# Altium schematic sheet Safety_Protections.SchDoc: Safety Protections
size A3; DrawnBy: Juan Tinazzo; SheetNumber: 2; SheetTotal: 7; Number: CB-SP; Company: TM
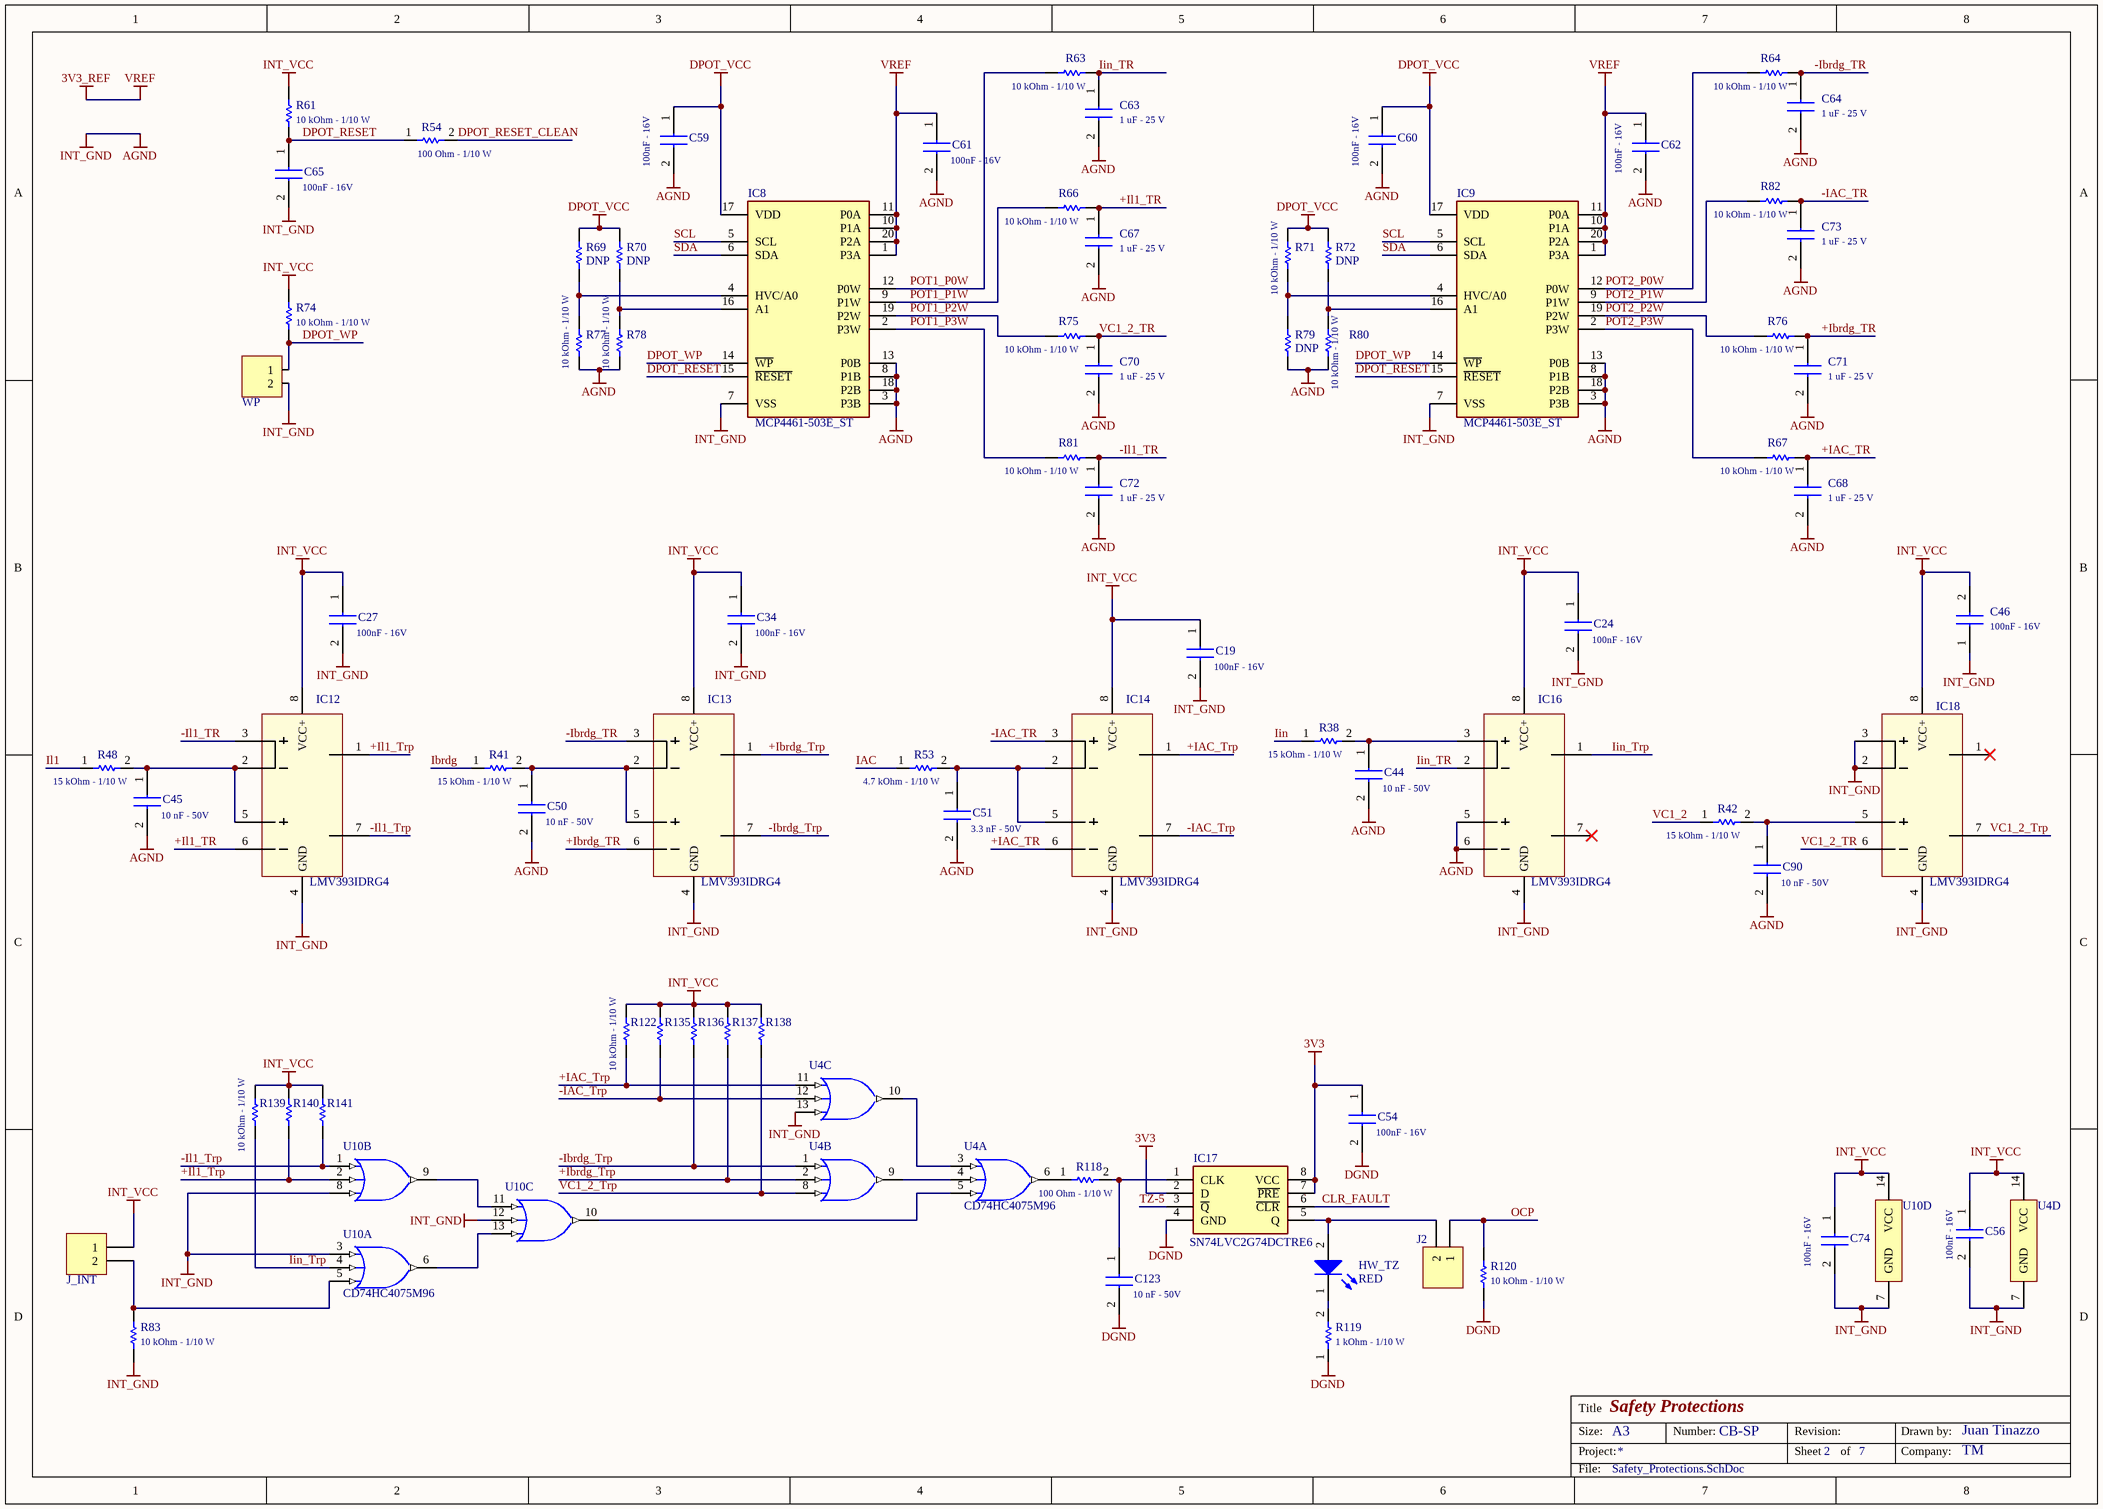
[diagram p0: Safety_Protections.SchDoc]

## Parts
C19  value 100nF - 16V  [CAPC1608X95N]  (hidden comment: 100n 16V 0603)
C24  value 100nF - 16V  [CAPC1608X95N]  (hidden comment: 100n 16V 0603)
C27  value 100nF - 16V  [CAPC1608X95N]  (hidden comment: 100n 16V 0603)
C34  value 100nF - 16V  [CAPC1608X95N]  (hidden comment: 100n 16V 0603)
C44  value 10 nF - 50V  [C0603]  (hidden comment: 220p 50V 5% 0603)
C45  value 10 nF - 50V  [C0603]  (hidden comment: 220p 50V 5% 0603)
C46  value 100nF - 16V  [CAPC1608X95N]  (hidden comment: 100n 16V 0603)
C50  value 10 nF - 50V  [C0603]  (hidden comment: 220p 50V 5% 0603)
C51  value 3.3 nF - 50V  [C0603]  (hidden comment: 220p 50V 5% 0603)
C54  value 100nF - 16V  [CAPC1608X95N]  (hidden comment: 100n 16V 0603)
C56  value 100nF - 16V  [CAPC1608X95N]  (hidden comment: 100n 16V 0603)
C59  value 100nF - 16V  [CAPC1608X95N]  (hidden comment: 100n 16V 0603)
C60  value 100nF - 16V  [CAPC1608X95N]  (hidden comment: 100n 16V 0603)
C61  value 100nF - 16V  [CAPC1608X95N]  (hidden comment: 100n 16V 0603)
C62  value 100nF - 16V  [CAPC1608X95N]  (hidden comment: 100n 16V 0603)
C63  value 1 uF - 25 V  [CAPC2012X135N]  (hidden comment: 1u)
C64  value 1 uF - 25 V  [CAPC2012X135N]  (hidden comment: 1u)
C65  value 100nF - 16V  [CAPC1608X95N]  (hidden comment: 100n 16V 0603)
C67  value 1 uF - 25 V  [CAPC2012X135N]  (hidden comment: 1u)
C68  value 1 uF - 25 V  [CAPC2012X135N]  (hidden comment: 1u)
C70  value 1 uF - 25 V  [CAPC2012X135N]  (hidden comment: 1u)
C71  value 1 uF - 25 V  [CAPC2012X135N]  (hidden comment: 1u)
C72  value 1 uF - 25 V  [CAPC2012X135N]  (hidden comment: 1u)
C73  value 1 uF - 25 V  [CAPC2012X135N]  (hidden comment: 1u)
C74  value 100nF - 16V  [CAPC1608X95N]  (hidden comment: 100n 16V 0603)
C90  value 10 nF - 50V  [C0603]  (hidden comment: 220p 50V 5% 0603)
C123  value 10 nF - 50V  [C0603]  (hidden comment: 220p 50V 5% 0603)
HW_TZ  RED  [LEDC1608X80N]
IC8  MCP4461-503E_ST  [SOP65P640X120-20N]
IC9  MCP4461-503E_ST  [SOP65P640X120-20N]
IC12  LMV393IDRG4  [SOIC127P600X175-8N]
IC13  LMV393IDRG4  [SOIC127P600X175-8N]
IC14  LMV393IDRG4  [SOIC127P600X175-8N]
IC16  LMV393IDRG4  [SOIC127P600X175-8N]
IC17  SN74LVC2G74DCTRE6  [SOP65P400X130-8N]
IC18  LMV393IDRG4  [SOIC127P600X175-8N]
J2  Header 2  [HDR1X2]  (value not drawn)
J_INT  Header 2  [HDR1X2]  (value not drawn)
R38  value 15 kOhm - 1/10 W  [RESC1608X55N]  (hidden comment: CRCW0603100RFKEBC)
R41  value 15 kOhm - 1/10 W  [RESC1608X55N]  (hidden comment: CRCW0603100RFKEBC)
R42  value 15 kOhm - 1/10 W  [RESC1608X55N]  (hidden comment: CRCW0603100RFKEBC)
R48  value 15 kOhm - 1/10 W  [RESC1608X55N]  (hidden comment: CRCW0603100RFKEBC)
R53  value 4.7 kOhm - 1/10 W  [RESC1608X55N]  (hidden comment: CRCW0603100RFKEBC)
R54  value 100 Ohm - 1/10 W  [RESC1608X55N]  (hidden comment: CRCW0603100RFKEBC)
R61  value 10 kOhm - 1/10 W  [RESC1608X50N]  (hidden comment: CRCW060310K0FKEA)
R63  value 10 kOhm - 1/10 W  [RESC1608X50N]  (hidden comment: CRCW060310K0FKEA)
R64  value 10 kOhm - 1/10 W  [RESC1608X50N]  (hidden comment: CRCW060310K0FKEA)
R66  value 10 kOhm - 1/10 W  [RESC1608X50N]  (hidden comment: CRCW060310K0FKEA)
R67  value 10 kOhm - 1/10 W  [RESC1608X50N]  (hidden comment: CRCW060310K0FKEA)
R69  DNP  [RESC1608X50N]
R70  DNP  [RESC1608X50N]
R71  value 10 kOhm - 1/10 W  [RESC1608X50N]  (hidden comment: CRCW060310K0FKEA)
R72  DNP  [RESC1608X50N]
R74  value 10 kOhm - 1/10 W  [RESC1608X50N]  (hidden comment: CRCW060310K0FKEA)
R75  value 10 kOhm - 1/10 W  [RESC1608X50N]  (hidden comment: CRCW060310K0FKEA)
R76  value 10 kOhm - 1/10 W  [RESC1608X50N]  (hidden comment: CRCW060310K0FKEA)
R77  value 10 kOhm - 1/10 W  [RESC1608X50N]  (hidden comment: CRCW060310K0FKEA)
R78  value 10 kOhm - 1/10 W  [RESC1608X50N]  (hidden comment: CRCW060310K0FKEA)
R79  DNP  [RESC1608X50N]
R80  value 10 kOhm - 1/10 W  [RESC1608X50N]  (hidden comment: CRCW060310K0FKEA)
R81  value 10 kOhm - 1/10 W  [RESC1608X50N]  (hidden comment: CRCW060310K0FKEA)
R82  value 10 kOhm - 1/10 W  [RESC1608X50N]  (hidden comment: CRCW060310K0FKEA)
R83  value 10 kOhm - 1/10 W  [RESC1608X50N]  (hidden comment: CRCW060310K0FKEA)
R118  value 100 Ohm - 1/10 W  [RESC1608X55N]  (hidden comment: CRCW0603100RFKEBC)
R119  value 1 kOhm - 1/10 W  [RESC1608X55N]  (hidden comment: CRCW06031K00FKEAC)
R120  value 10 kOhm - 1/10 W  [RESC1608X50N]  (hidden comment: CRCW060310K0FKEA)
R122  value 10 kOhm - 1/10 W  [RESC1608X50N]  (hidden comment: CRCW060310K0FKEA)
R135  CRCW060310K0FKEA  [RESC1608X50N]  (value not drawn)
R136  CRCW060310K0FKEA  [RESC1608X50N]  (value not drawn)
R137  CRCW060310K0FKEA  [RESC1608X50N]  (value not drawn)
R138  CRCW060310K0FKEA  [RESC1608X50N]  (value not drawn)
R139  value 10 kOhm - 1/10 W  [RESC1608X50N]  (hidden comment: CRCW060310K0FKEA)
R140  CRCW060310K0FKEA  [RESC1608X50N]  (value not drawn)
R141  CRCW060310K0FKEA  [RESC1608X50N]  (value not drawn)
U4  CD74HC4075M96  [SOIC127P600X175-14N]  (parts A,B,C,D of 4)
U10  CD74HC4075M96  [SOIC127P600X175-14N]  (parts A,B,C,D of 4)
WP  Header 2  [HDR1X2]  (value not drawn)

## Nets
3V3: C54.1 IC17.2(D) IC17.7(~{PRE}) IC17.8(VCC)
3V3_REF: C61.1 C62.1 IC8.1(P3A) IC8.10(P1A) IC8.11(P0A) IC8.20(P2A) IC9.1(P3A) IC9.10(P1A) IC9.11(P0A) IC9.20(P2A)  [also labelled VREF]
AGND: C19.2 C24.2 C27.2 C34.2 C44.2 C45.2 C46.1 C50.2 C51.2 C56.2 C59.2 C60.2 C61.2 C62.2 C63.2 C64.2 C65.2 C67.2 C68.2 C70.2 C71.2 C72.2 C73.2 C74.2 C90.2 IC8.3(P3B) IC8.7(VSS) IC8.8(P1B) IC8.13(P0B) IC8.18(P2B) IC9.3(P3B) IC9.7(VSS) IC9.8(P1B) IC9.13(P0B) IC9.18(P2B) IC12.4(GND) IC13.4(GND) IC14.4(GND) IC16.4(GND) IC16.5(2IN+) IC16.6(2IN-) IC18.2(1IN-) IC18.3(1IN+) IC18.4(GND) R77.2 R78.2 R79.2 R80.2 R83.2 U4.7(GND) U4.13(3C) U10.3(1A) U10.7(GND) U10.8(2C) U10.12(3B) WP.2  [also labelled INT_GND]
DGND: C54.2 C123.2 IC17.4(GND) R119.1 R120.2
DPOT_VCC: C59.1 C60.1 IC8.17(VDD) IC9.17(VDD) R69.1 R70.1 R71.1 R72.1
INT_VCC: C19.1 C24.1 C27.1 C34.1 C46.2 C56.1 C74.1 IC12.8(VCC+) IC13.8(VCC+) IC14.8(VCC+) IC16.8(VCC+) IC18.8(VCC+) J_INT.1 R61.1 R74.1 R122.1 R135.1 R136.1 R137.1 R138.1 R139.1 R140.1 R141.1 U4.14(VCC) U10.14(VCC)
+IAC_TR: C68.1 IC14.6(2IN-) R67.1
+IAC_Trp: IC14.1(1OUT) R122.2 U4.11(3A)
+Ibrdg_TR: C71.1 IC13.6(2IN-) R76.1
+Ibrdg_Trp: IC13.1(1OUT) R137.2 U4.2(2B)
+Il1_TR: C67.1 IC12.6(2IN-) R66.1
+Il1_Trp: IC12.1(1OUT) R140.2 U10.2(2B)
-IAC_TR: C73.1 IC14.3(1IN+) R82.1
-IAC_Trp: IC14.7(2OUT) R135.2 U4.12(3B)
-Ibrdg_TR: C64.1 IC13.3(1IN+) R64.1
-Ibrdg_Trp: IC13.7(2OUT) R136.2 U4.1(2A)
-Il1_TR: C72.1 IC12.3(1IN+) R81.1
-Il1_Trp: IC12.7(2OUT) R141.2 U10.1(2A)
CLR_FAULT: IC17.6(~{CLR})
DPOT_RESET: C65.1 IC8.15(~{RESET}) IC9.15(~{RESET}) R54.1 R61.2
DPOT_RESET_CLEAN: R54.2
DPOT_WP: IC8.14(~{WP}) IC9.14(~{WP}) R74.2 WP.1
IAC: R53.1
Ibrdg: R41.1
Iin: R38.1
Iin_TR: C63.1 IC16.2(1IN-) R63.1
Iin_Trp: IC16.1(1OUT) R139.2 U10.4(1B)
Il1: R48.1
OCP: J2.1 R120.1
POT1_P0W: IC8.12(P0W) R63.2
POT1_P1W: IC8.9(P1W) R66.2
POT1_P2W: IC8.19(P2W) R75.2
POT1_P3W: IC8.2(P3W) R81.2
POT2_P0W: IC9.12(P0W) R64.2
POT2_P1W: IC9.9(P1W) R82.2
POT2_P2W: IC9.19(P2W) R76.2
POT2_P3W: IC9.2(P3W) R67.2
SCL: IC8.5(SCL) IC9.5(SCL)
SDA: IC8.6(SDA) IC9.6(SDA)
TZ-5: IC17.3(~{Q})
VC1_2: R42.1
VC1_2_TR: C70.1 IC18.6(2IN-) R75.1
VC1_2_Trp: IC18.7(2OUT) R138.2 U4.8(2C)
NetC44_1: C44.1 IC16.3(1IN+) R38.2
NetC45_1: C45.1 IC12.2(1IN-) IC12.5(2IN+) R48.2
NetC50_1: C50.1 IC13.2(1IN-) IC13.5(2IN+) R41.2
NetC51_1: C51.1 IC14.2(1IN-) IC14.5(2IN+) R53.2
NetC90_1: C90.1 IC18.5(2IN+) R42.2
NetC123_1: C123.1 IC17.1(CLK) R118.2
NetHW_TZ_1: HW_TZ.1(K) R119.2
NetHW_TZ_2: HW_TZ.2(A) IC17.5(Q) J2.2
NetIC8_4: IC8.4(HVC/A0) R69.2 R77.1
NetIC8_16: IC8.16(A1) R70.2 R78.1
NetIC9_4: IC9.4(HVC/A0) R71.2 R79.1
NetIC9_16: IC9.16(A1) R72.2 R80.1
NetJ_INT_2: J_INT.2 R83.1 U10.5(1C)
NetR118_1: R118.1 U4.6(1Y)
NetU4_3: U4.3(1A) U4.10(3Y)
NetU4_4: U4.4(1B) U4.9(2Y)
NetU4_5: U4.5(1C) U10.10(3Y)
NetU10_6: U10.6(1Y) U10.13(3C)
NetU10_9: U10.9(2Y) U10.11(3A)

Not connected (* = marked no-connect by the designer): IC16 7(2OUT)*; IC18 1(1OUT)*

## Notes on the sheet
- Title
- Size:
- Project:
- A3
- Number:
- Revision:
- Sheet
- of
- Drawn by:
- Company:
- File:

## Library data of the parts
C19 C24 C27 C34 C46 C54 C56 C59-C62 C65 C74 = EMK107B7104KA-T: Capacitor; Manufacturer_Name: TAIYO YUDEN; Datasheet Link: http://www.farnell.com/datasheets/746258.pdf; Height: 0.95mm; Manufacturer_Part_Number: EMK107B7104KA-T; Mouser Part Number: 963-EMK107B7104KA-T; Arrow Part Number: EMK107B7104KA-T; Arrow Price/Stock: https://www.arrow.com/en/products/emk107b7104ka-t/taiyo-yuden
  C19 C24 C27 C34 C54 C56 C59-C62 C65 C74: Mouser Price/Stock: https://www.mouser.co.uk/ProductDetail/Taiyo-Yuden/EMK107B7104KA-T?qs=I6KAKw0tg2ybqzX8hKPgfw%3D%3D
  C46: Mouser Price/Stock: https://www.mouser.co.uk/ProductDetail/TAIYO-YUDEN/EMK107B7104KA-T?qs=I6KAKw0tg2ybqzX8hKPgfw%3D%3D
C44 C45 C50 C90 C123 = C0603C221J5HACAUTO: Capacitor; Manufacturer_Name: KEMET; Manufacturer_Part_Number: CGA3E2X7R1H103K080AA; Datasheet Link: https://content.kemet.com/datasheets/KEM_C1007_X8R_ULTRA_150C_SMD.pdf; Height: 0.87mm; Mouser Part Number: 80-C0603C221J5HAUTO; Mouser Price/Stock: https://www.mouser.co.uk/ProductDetail/KEMET/C0603C221J5HACAUTO?qs=j%252B1pi9TdxUZayjzZ3rh80g%3D%3D
C51 = C0603C221J5HACAUTO: Capacitor; Manufacturer_Name: KEMET; Datasheet Link: https://content.kemet.com/datasheets/KEM_C1007_X8R_ULTRA_150C_SMD.pdf; Height: 0.87mm; Manufacturer_Part_Number: C0603C221J5HACAUTO; Mouser Part Number: 80-C0603C221J5HAUTO; Mouser Price/Stock: https://www.mouser.co.uk/ProductDetail/KEMET/C0603C221J5HACAUTO?qs=j%252B1pi9TdxUZayjzZ3rh80g%3D%3D
C63 C64 C67 C68 C70-C73 = CL21B105KAFNNNG: Capacitor; Manufacturer_Name: SAMSUNG; Datasheet Link: https://datasheet.datasheetarchive.com/originals/distributors/Datasheets-DGA8/2478773.pdf; Height: 1.35mm; Manufacturer_Part_Number: CL21B105KAFNNNG; Mouser Part Number: 187-CL21B105KAFNNNG; Mouser Price/Stock: https://www.mouser.co.uk/ProductDetail/Samsung-Electro-Mechanics/CL21B105KAFNNNG?qs=yOVawPpwOwmXkU%252BG0TK%2F5g%3D%3D; Arrow Part Number: CL21B105KAFNNNG; Arrow Price/Stock: https://www.arrow.com/en/products/cl21b105kafnnng/samsung-electro-mechanics?region=europe
HW_TZ = 150060RS75000: LED; Manufacturer_Name: Wurth Elektronik; Value: Led Rojo 0603; Datasheet Link: http://katalog.we-online.de/led/datasheet/150060RS75000.pdf; Height: 0.8mm; Manufacturer_Part_Number: 150060RS75000; Mouser Part Number: 710-150060RS75000; Mouser Price/Stock: https://www.mouser.co.uk/ProductDetail/Wurth-Elektronik/150060RS75000?qs=LlUlMxKIyB3QnmZ3fw%2FVCA%3D%3D
IC8 IC9 = MCP4461-503E_ST: Integrated Circuit; Manufacturer_Name: Microchip; Manufacturer_Part_Number: MCP4461-503E/ST; Value: Circuitos integrados de potenciómetros digitales 50k I2C quad ch 8bit nonvolatile memory; Datasheet Link: https://datasheet.datasheetarchive.com/originals/dk/DKDS-14/279656.pdf; Height: 1.2mm; Mouser Part Number: 579-MCP4461503EST; Mouser Price/Stock: https://www.mouser.co.uk/ProductDetail/Microchip-Technology/MCP4461-503E-ST?qs=hort8UWU32ogb6GG%252BEGOkQ%3D%3D; Arrow Part Number: MCP4461-503E/ST; Arrow Price/Stock: https://www.arrow.com/en/products/mcp4461-503est/microchip-technology
IC12-IC14 IC16 IC18 = LMV393IDRG4: Integrated Circuit; Manufacturer_Name: Texas Instruments; Value: Comparadores analógicos Dual Gen Purp; Datasheet Link: https://www.ti.com/lit/gpn/lmv393; Height: 1.75mm; Manufacturer_Part_Number: LMV393IDRG4; Mouser Part Number: 595-LMV393IDRG4; Mouser Price/Stock: https://www.mouser.co.uk/ProductDetail/Texas-Instruments/LMV393IDRG4?qs=tP77tliwutC5frth4oKpcg%3D%3D; Arrow Part Number: LMV393IDRG4; Arrow Price/Stock: https://www.arrow.com/en/products/lmv393idrg4/texas-instruments?region=nac
IC17 = SN74LVC2G74DCTRE6: Integrated Circuit; Manufacturer_Name: Texas Instruments; Value: Single Positive-Edge-Triggered D-Type Flip-Flop; Datasheet Link: https://www.ti.com/lit/ds/symlink/sn74lvc2g74.pdf?ts=1629109043918&ref_url=https%253A%252F%252Fwww.ti.com%252Fstore%252Fti%252Fen%252Fp%252Fproduct%252F%253Fp%253DSN74LVC2G74DCTRE6; Height: 1.3mm; Manufacturer_Part_Number: SN74LVC2G74DCTRE6; Mouser Part Number: 595-74LVC2G74DCTRE6; Mouser Price/Stock: https://www.mouser.co.uk/ProductDetail/Texas-Instruments/SN74LVC2G74DCTRE6?qs=byeeYqUIh0MaOLKxYGSbxw%3D%3D; Arrow Part Number: SN74LVC2G74DCTRE6; Arrow Price/Stock: https://www.arrow.com/en/products/sn74lvc2g74dctre6/texas-instruments?region=nac
J2 J_INT WP = Header 2: Header, 2-Pin; Manufacturer_Part_Number: Header 2.54 mm 2P; Value: 2P
R38 R41 R42 R48 = CRCW0603100RFKEBC: Resistor; Manufacturer_Name: Vishay; Manufacturer_Part_Number: CRCW060315K0FKEAC; Datasheet Link: https://www.vishay.com/docs/28773/crcwce3.pdf; Height: 0.55mm; Mouser Part Number: 71-CRCW0603100RFKEBC; Mouser Price/Stock: https://www.mouser.co.uk/ProductDetail/Vishay-Dale/CRCW0603100RFKEBC?qs=wd5RIQLrsJhdvQFtBw4oWg%3D%3D; Arrow Part Number: CRCW0603100RFKEBC; Arrow Price/Stock: https://www.arrow.com/en/products/crcw0603100rfkebc/vishay?region=nac
R53 = CRCW0603100RFKEBC: Resistor; Manufacturer_Name: Vishay; Manufacturer_Part_Number: CRCW06034K70FKEAHP; Datasheet Link: https://www.vishay.com/docs/28773/crcwce3.pdf; Height: 0.55mm; Mouser Part Number: 71-CRCW0603100RFKEBC; Mouser Price/Stock: https://www.mouser.co.uk/ProductDetail/Vishay-Dale/CRCW0603100RFKEBC?qs=wd5RIQLrsJhdvQFtBw4oWg%3D%3D; Arrow Part Number: CRCW0603100RFKEBC; Arrow Price/Stock: https://www.arrow.com/en/products/crcw0603100rfkebc/vishay?region=nac
R54 R118 = CRCW0603100RFKEBC: Resistor; Manufacturer_Name: Vishay; Datasheet Link: https://www.vishay.com/docs/28773/crcwce3.pdf; Height: 0.55mm; Manufacturer_Part_Number: CRCW0603100RFKEBC; Mouser Part Number: 71-CRCW0603100RFKEBC; Mouser Price/Stock: https://www.mouser.co.uk/ProductDetail/Vishay-Dale/CRCW0603100RFKEBC?qs=wd5RIQLrsJhdvQFtBw4oWg%3D%3D; Arrow Part Number: CRCW0603100RFKEBC; Arrow Price/Stock: https://www.arrow.com/en/products/crcw0603100rfkebc/vishay?region=nac
R61 R63 R64 R66 R67 R71 R74-R78 R80-R83 R120 R122 R139 = CRCW060310K0FKEA: Resistor; Manufacturer_Name: Vishay; Datasheet Link: http://www.vishay.com/docs/20035/dcrcwe3.pdf; Height: 0.5mm; Manufacturer_Part_Number: CRCW060310K0FKEA; Mouser Part Number: 71-CRCW0603-10K-E3; Mouser Price/Stock: https://www.mouser.co.uk/ProductDetail/Vishay-Dale/CRCW060310K0FKEA?qs=pAO1Z172M84BVnhDjtnsoQ%3D%3D; Arrow Part Number: CRCW060310K0FKEA; Arrow Price/Stock: https://www.arrow.com/en/products/crcw060310k0fkea/vishay?region=nac
R69 R70 R72 R79 R135-R138 R140 R141 = CRCW060310K0FKEA: Resistor; Manufacturer_Name: Vishay; Value: 10 kOhm - 1/10 W; Datasheet Link: http://www.vishay.com/docs/20035/dcrcwe3.pdf; Height: 0.5mm; Manufacturer_Part_Number: CRCW060310K0FKEA; Mouser Part Number: 71-CRCW0603-10K-E3; Mouser Price/Stock: https://www.mouser.co.uk/ProductDetail/Vishay-Dale/CRCW060310K0FKEA?qs=pAO1Z172M84BVnhDjtnsoQ%3D%3D; Arrow Part Number: CRCW060310K0FKEA; Arrow Price/Stock: https://www.arrow.com/en/products/crcw060310k0fkea/vishay?region=nac
R119 = CRCW06031K00FKEAC: Resistor; Manufacturer_Name: Vishay; Datasheet Link: https://www.vishay.com/docs/28773/crcwce3.pdf; Height: 0.55mm; Manufacturer_Part_Number: CRCW06031K00FKEAC; Mouser Part Number: 71-CRCW06031K00FKEAC; Mouser Price/Stock: https://www.mouser.co.uk/ProductDetail/Vishay-Dale/CRCW06031K00FKEAC?qs=E3Y5ESvWgWOQ7ePIWbGVFg%3D%3D; Arrow Part Number: CRCW06031K00FKEAC; Arrow Price/Stock: https://www.arrow.com/en/products/crcw06031k00fkeac/vishay?region=nac
U4 U10 = CD74HC4075M96: High Speed CMOS Logic Triple 3-Input OR Gates, D0014A, LARGE T&R; Manufacturer: Texas Instruments; VCC(Min)(V): 2; VCC(Max)(V): 6; ICC @ Nom Voltage(Max)(mA): 0.02; Bits(#): 3; F @ Nom Voltage(Max)(Mhz): 70; Rating: Catalog; Voltage(Nom)(V): 5; Output Drive (IOL/IOH)(Max)(mA): 5.2/-5.2; tpd @ Nom Voltage(Max)(ns): 25; Value: Puertas lógicas Triple 3-Input OR; DatasheetVersion: SCHS210G; PackageReference: D0014A; Generic Part Number: CD74HC4075; Output Type: CMOS; Input Type: CMOS; Operating Temperature Range(C): -55 to 125; Code_JEDEC: MS-012; PartNumber: CD74HC4075M96; ComponentLink1Description: Manufacturer URL; ComponentLink1URL: http://www.ti.com/; ComponentLink2Description: Datasheet; ComponentLink2URL: http://www.ti.com/lit/ds/symlink/cd74hc4075.pdf; ComponentLink3Description: Package Specification; ComponentLink3URL: http://www.ti.com/lit/ml/mpds177g/mpds177g.pdf; Datasheet Link: http://www.ti.com/lit/ds/symlink/cd74hc4075.pdf; Mouser Part Number: 595-CD74HC4075M96; Manufacturer_Part_Number: CD74HC4075M96